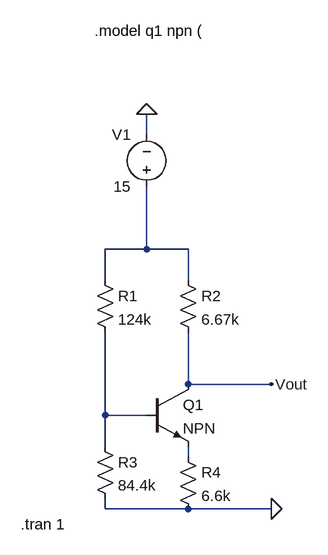
[diagram p0: schematic 4lutrans.asc]
4lutrans.asc, the LTspice schematic file:
Version 4
SHEET 1 880 680
WIRE -16 -240 -16 -272
WIRE -16 -64 -16 -160
WIRE -16 -64 -80 -64
WIRE 48 -64 -16 -64
WIRE -80 -16 -80 -64
WIRE 48 -16 48 -64
WIRE 48 144 48 64
WIRE 176 144 48 144
WIRE -80 192 -80 64
WIRE -16 192 -80 192
WIRE -80 240 -80 192
WIRE 48 256 48 240
WIRE -80 336 -80 320
WIRE 48 336 -80 336
WIRE 176 336 48 336
FLAG 176 336 0
FLAG 176 144 Vout
FLAG -16 -272 0
SYMBOL npn -16 144 R0
SYMATTR InstName Q1
SYMBOL res 32 -32 R0
SYMATTR InstName R2
SYMATTR Value 6.67k
SYMBOL res -96 -32 R0
SYMATTR InstName R1
SYMATTR Value 124k
SYMBOL res -96 224 R0
SYMATTR InstName R3
SYMATTR Value 84.4k
SYMBOL res 32 240 R0
SYMATTR InstName R4
SYMATTR Value 6.6k
SYMBOL voltage -16 -144 R180
WINDOW 0 24 96 Left 2
WINDOW 3 24 16 Left 2
WINDOW 123 0 0 Left 0
WINDOW 39 0 0 Left 0
SYMATTR InstName V1
SYMATTR Value 15
TEXT -210 360 Left 2 !.tran 1
TEXT -96 -400 Left 2 !.model q1 npn (

The netlist it stands for:
* 4lutrans.asc
Q1 Vout N002 N003 0 NPN
R2 N001 Vout 6.67k
R1 N001 N002 124k
R3 N002 0 84.4k
R4 N003 0 6.6k
V1 N001 0 15
.model NPN NPN
.model PNP PNP
.lib standard.bjt
.tran 1
.model q1 npn (
.backanno
.end